# EAGLE design pc_max86150_breakout_qwiic2part_part1 (EAGLE 6.6.0)
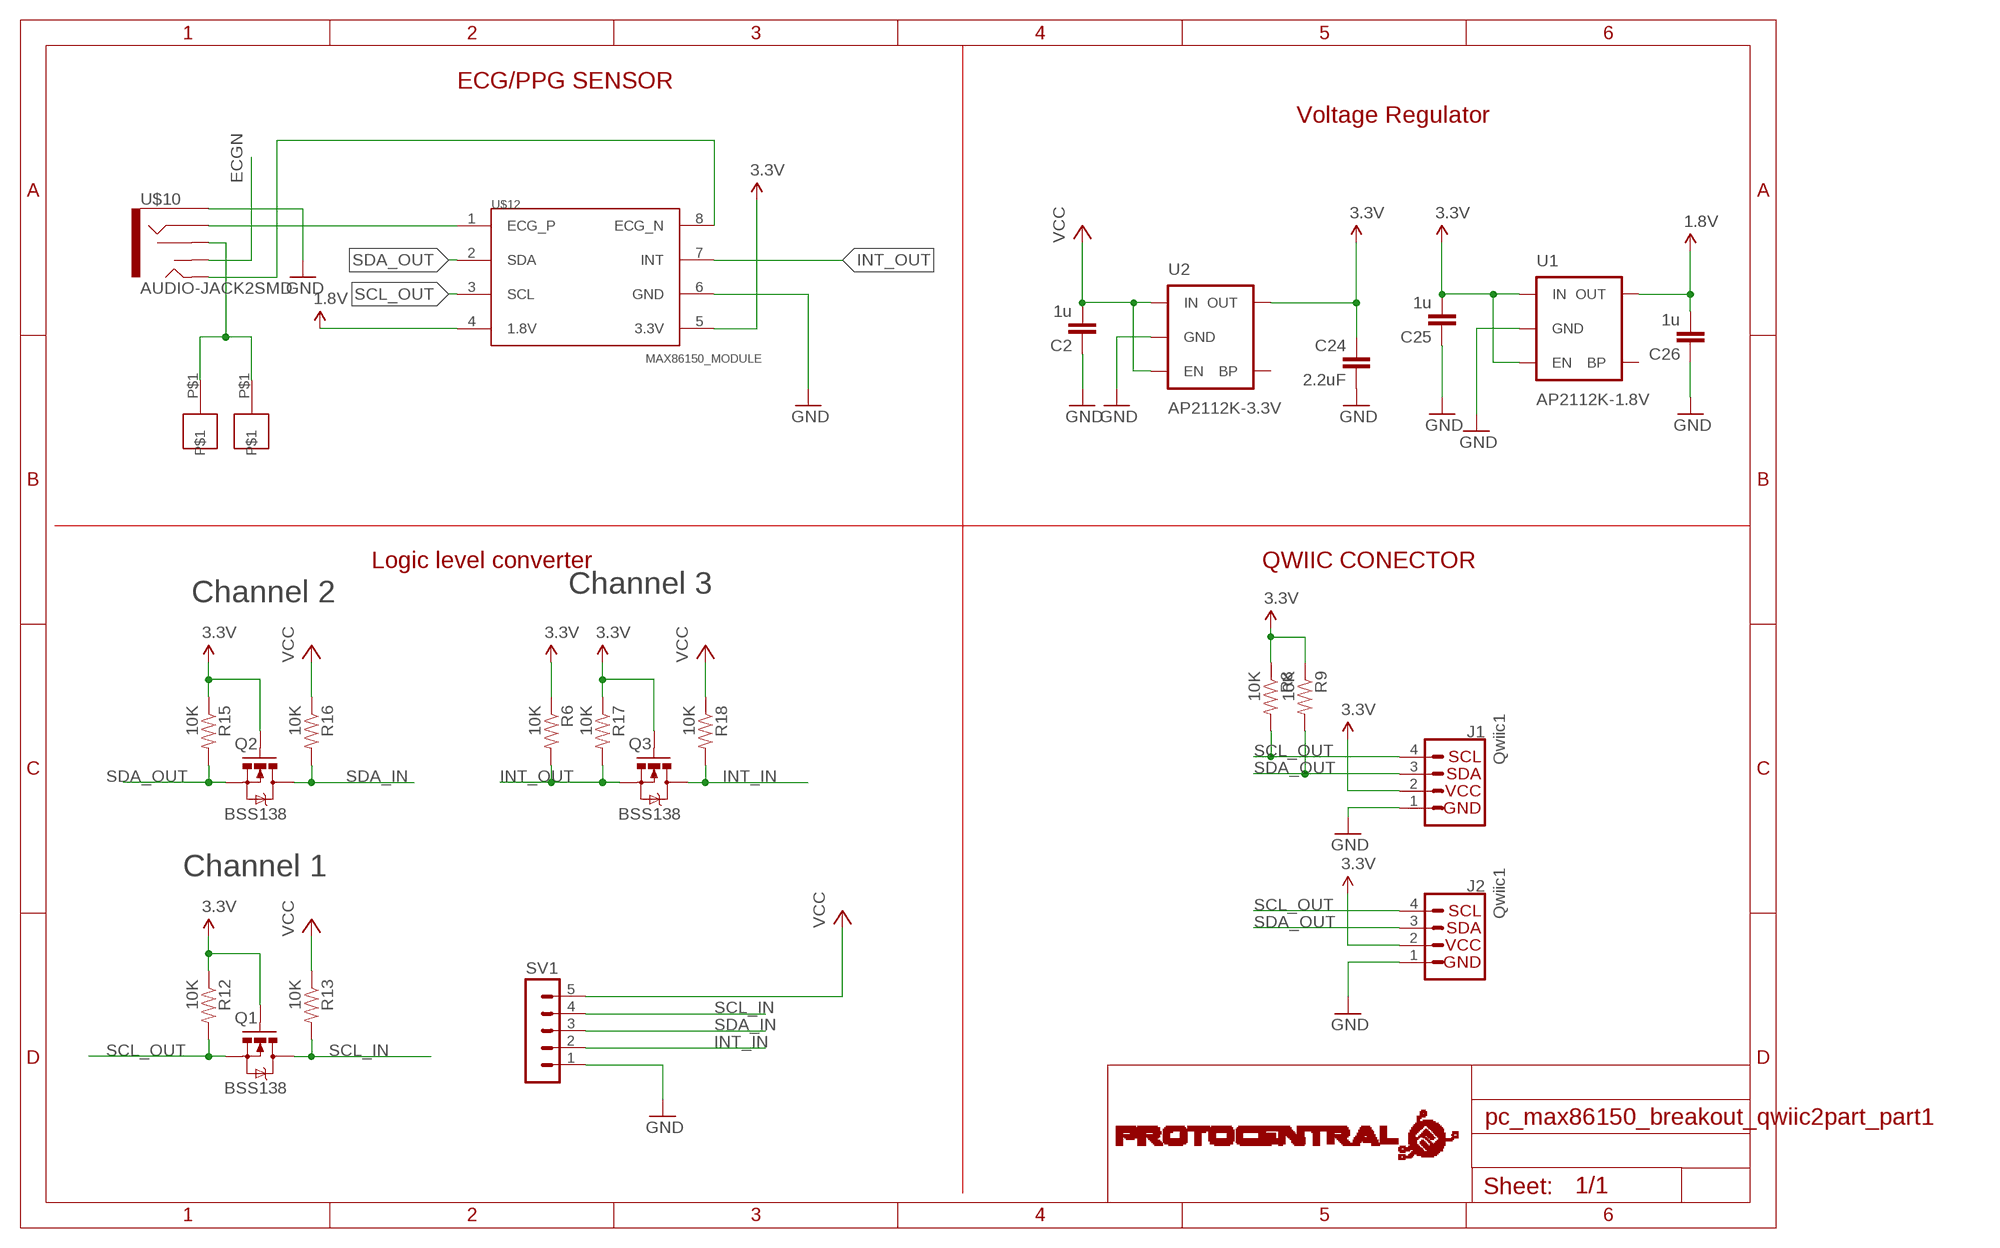
[diagram p0: schematic, sheet 1]

## Parts
C2  1u  C-EUC0402  [C0402]
C24  2.2uF  C-EUC0402  [C0402]
C25  1u  C-EUC0402  [C0402]
C26  1u  C-EUC0402  [C0402]
J1  Qwiic1  QWIIC_CONNECTORJS-1MM  [1X04_1MM_RA]
J2  Qwiic1  QWIIC_CONNECTORJS-1MM  [1X04_1MM_RA]
Q1  BSS138  MOSFET-NCHANNELSMD  [SOT23-3]
Q2  BSS138  MOSFET-NCHANNELSMD  [SOT23-3]
Q3  BSS138  MOSFET-NCHANNELSMD  [SOT23-3]
R6  10K  RESISTOR0402-RES  [0402-RES]
R8  10K  RESISTOR0402-RES  [0402-RES]
R9  10K  RESISTOR0402-RES  [0402-RES]
R12  10K  RESISTOR0402-RES  [0402-RES]
R13  10K  RESISTOR0402-RES  [0402-RES]
R15  10K  RESISTOR0402-RES  [0402-RES]
R16  10K  RESISTOR0402-RES  [0402-RES]
R17  10K  RESISTOR0402-RES  [0402-RES]
R18  10K  RESISTOR0402-RES  [0402-RES]
SV1  MA05-1  [MA05-1]
U1  AP2112K-1.8V  V_REG_LDOSMD  [SOT23-5]
U2  AP2112K-3.3V  V_REG_LDOSMD  [SOT23-5]
U$3  PROTY_LOGO_WITH_TEXT  [PROTY_WITH_TEXT]
U$4  ECG_PAD  [ECG_PAD1]
U$10  AUDIO-JACK2SMD  [AUDIO-JACK-3.5MM-SMD]
U$12  MAX86150_MODULE  [MAX86150_MODULE]
U$13  ECG_PAD  [ECG_PAD1]

## Nets
1.8V: C26.2 U1.5(OUT) U$12.4(1.8V)
3.3V: C24.1 C25.2 J1.2 J2.2 Q1.1(G) Q2.1(G) Q3.1(G) R6.1 R8.1 R9.1 R12.1 R15.1 R17.1 U1.1(IN) U1.3(EN) U2.5(OUT) U$12.5(3.3V)
ECGN: U$10.TSH
GND: C2.1 C24.2 C25.1 C26.1 J1.1 J2.1 SV1.1 U1.2(GND) U2.2(GND) U$10.SLEEVE U$12.6(GND)
INT_IN: Q3.3(D) R18.2 SV1.2
INT_OUT: Q3.2(S) R6.2 R17.2 U$12.7(INT)
N$7: U$10.TIP U$12.8(ECG_N)
N$8: U$10.RING U$12.1(ECG_P)
N$9: U$4.P$1 U$10.RSH U$13.P$1
SCL_IN: Q1.3(D) R13.2 SV1.4
SCL_OUT: J1.4 J2.4 Q1.2(S) R8.2 R12.2 U$12.3(SCL)
SDA_IN: Q2.3(D) R16.2 SV1.3
SDA_OUT: J1.3 J2.3 Q2.2(S) R9.2 R15.2 U$12.2(SDA)
VCC: C2.2 R13.1 R16.1 R18.1 SV1.5 U2.1(IN) U2.3(EN)
Unconnected: U1.4(BP) U2.4(BP)

## Notes on the sheet
- ECG/PPG SENSOR
- Voltage Regulator
- Logic level converter | QWIIC CONECTOR
- Channel 2 | Channel 3
- Channel 1

## Library data of the parts
C2 C24-C26 = rcl:C-EU: CAPACITOR, European symbol
J1 J2 = SparkFun-Connectors:QWIIC_CONNECTOR: SparkFun I2C Standard Qwiic Connector An SMD 1mm pitch JST connector makes it easy and quick (get it? Qwiic?) to connect I2C devices to each other. The Qwiic system <http://www.sparkfun.com/qwiic> enables fast and solderless connection between popular platforms and various sensors and actuators. We carry 200mm <https://www.sparkfun.com/products/14204>, 100mm <https://www.sparkfun.com/products/14205>, 50mm <https://www.sparkfun.com/products/14206>, and breadboard friendly <https://www.sparkfun.com/products/14207> Qwiic cables. We also offer 10 pcs strips <https://www.sparkfun.com/products/14323> the SMD connectors.; PROD_ID: CONN-13694
Q1-Q3 = SparkFun:MOSFET-NCHANNEL
R6 R8 R9 R12 R13 R15-R18 = SparkFun:RESISTOR: Resistor Basic schematic elements and footprints for 0603, 1206, and PTH resistors.
SV1 = con-lstb:MA05-1: PIN HEADER; OC_FARNELL: unknown; OC_NEWARK: unknown
U1 U2 = SparkFun-PowerIC:V_REG_LDO: Voltage Regulator LDO Standard 150mA LDO voltage regulator in SOT-23 layout. Micrel part MIC5205. BP (by-pass) pin is used to lower output noise with 470pF cap.; PROD_ID: VREG-12457
U$3 = circuitects:PROTY_LOGO_WITH_TEXT
U$4 U$13 = circuitects:ECG_PAD
U$10 = SparkFun:AUDIO-JACK2
U$12 = circuitects:MAX86150_MODULE

## Board
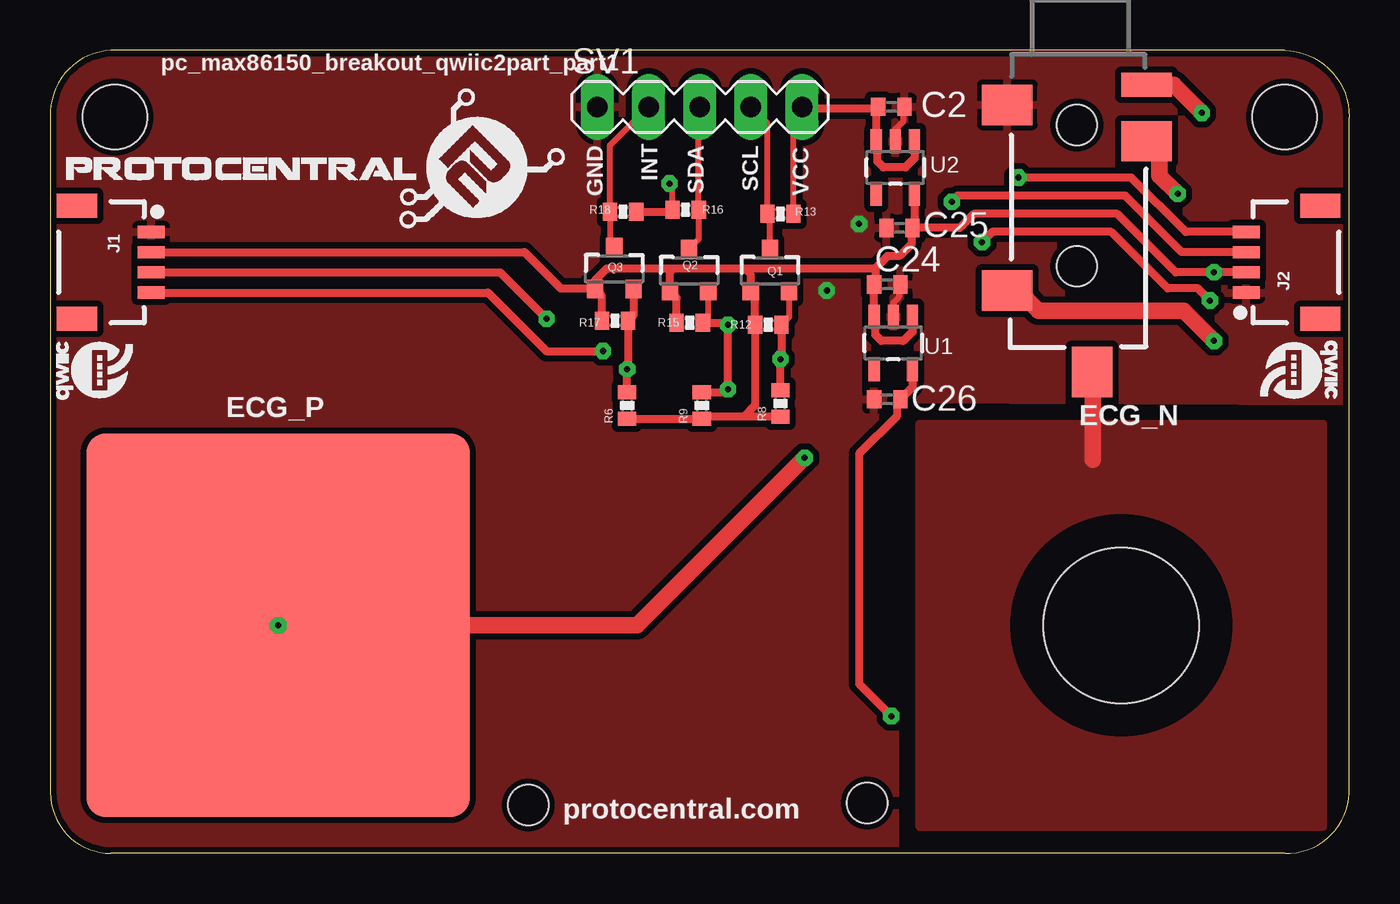
[diagram p1: board, top side]
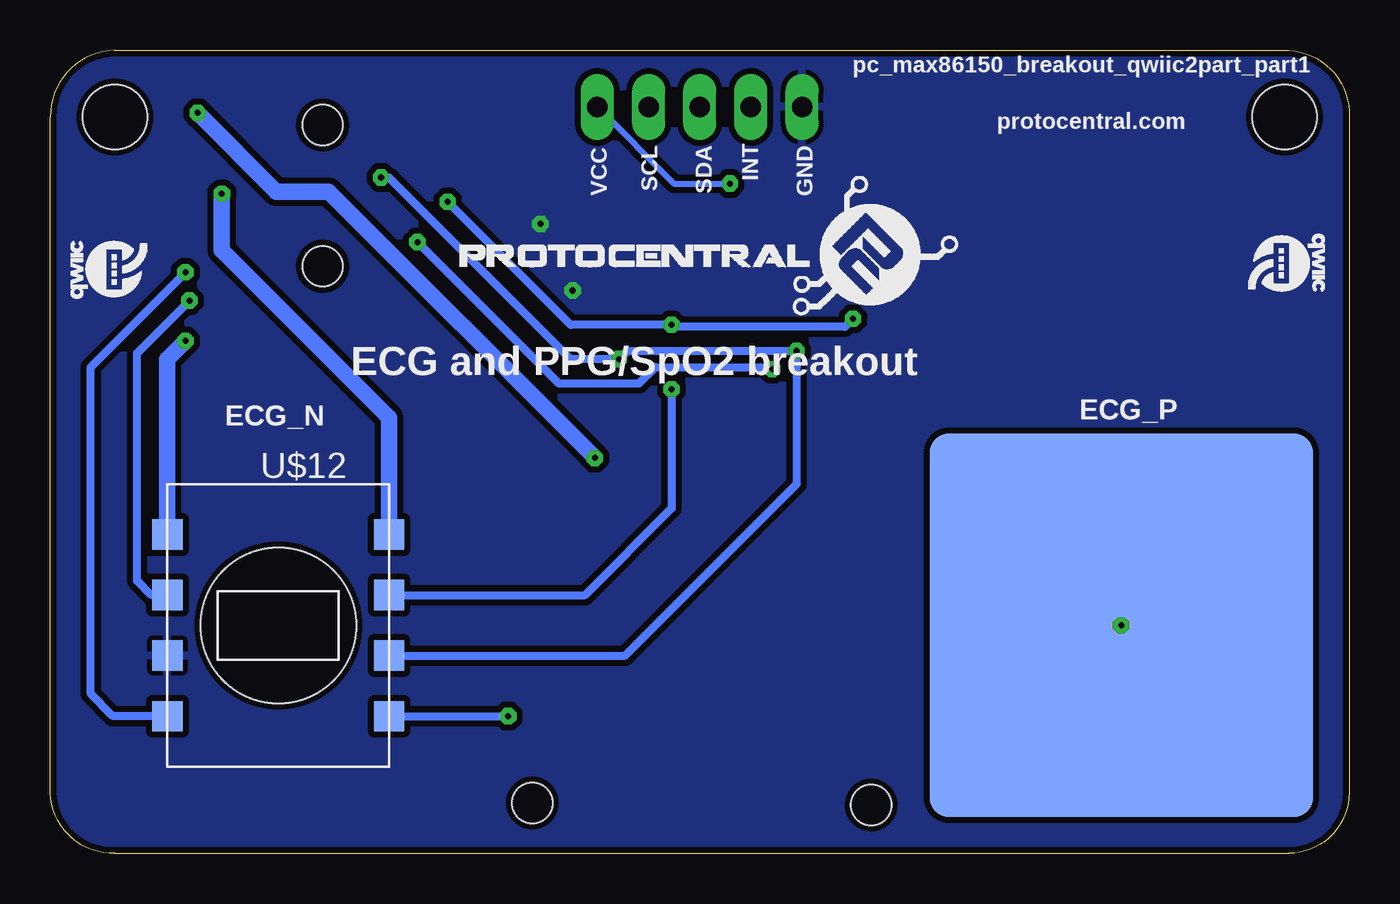
[diagram p2: board, bottom side, seen from below]

Size 64.4 x 39.8 mm. Coordinates in mm from the lower left corner, seen from the top.
Outline: 0,36.5 0,3 arc90 3,0 61.2,0 arc90 64.4,3 64.4,36.5 arc90 61.2,39.8 3,39.8 arc90 0,36.5
Copper layers (1*2*15*16): Top 0.035mm / dielectric 1.5mm / Route2 0.035mm / dielectric 0.15mm / Route15 0.035mm / dielectric 0.2mm / Bottom 0.035mm
Design rules "Circuitects-Rules": minimum track width 6mil, minimum drill 0.3mm, track to track 6mil, track to pad 6mil, pad to pad 6mil, via to via 6mil, smd to smd 6mil, copper to edge 10mil, drill to drill 8mil, minimum pad ring 12mil, minimum via ring 10mil, stop-mask expansion 4mil, vias tented up to drill 25mil, thermal gap 10mil
Holes 3.2 mm at 3.2,36.5 61.2,36.5
Holes 2 mm at 23.7,2.4 40.5,2.5
Holes 7.7 mm at 53.1,11.3
tRestrict: area 47.6,5.8 to 58.6,16.8

### Footprints (pad centres in the part's own frame; a part is rotated, then mirrored left to right if it is on the bottom)
C0402 = smd 0.7 x 0.9: 1 -0.65,0; 2 0.65,0
1X04_1MM_RA = smd 0.6 x 1.35: 1 -1.5,0; 2 -0.5,0; 3 0.5,0; 4 1.5,0 | smd 1.2 x 2: NC1 2.8,-3.675; NC2 -2.8,-3.675
SOT23-3 = smd 0.8 x 0.9: 1 -0.95,-1; 2 0.95,-1; 3 0,1.1
0402-RES = smd 0.7 x 0.9: 1 -0.65,0; 2 0.65,0
MA05-1 = drill 1.016 long: 1 -5.08,0; 2 -2.54,0; 3 0,0; 4 2.54,0; 5 5.08,0
SOT23-5 = smd 0.55 x 1.2: 1 -0.95,-1.3; 2 0,-1.3; 3 0.95,-1.3; 4 0.95,1.3; 5 -0.95,1.3
ECG_PAD1 = smd 19 x 19: P$1 0,0
AUDIO-JACK-3.5MM-SMD = smd 2 x 2.5: RING 4.3,3.45; SLEEVE 2.5,-3.45; TIP 11.7,-3.45 | smd 1.2 x 2.5: RSH 1.5,3.45 | smd 2.5 x 2: TSH 15.75,0.75 | hole 2: 3.5,0; 10.5,0
MAX86150_MODULE = smd 1.5 x 1.5 bottom: 1 -5.5,4.5; 2 -5.5,1.5; 3 -5.5,-1.5; 4 -5.5,-4.5; 5 5.5,-4.5; 6 5.5,-1.5; 7 5.5,1.5; 8 5.5,4.5

### Placement (x,y rotation side)
C2  41.7,37 180 top
C24  41.5,28.2 0 top
C25  42.1,31 0 top
C26  41.5,22.5 0 top
J1  5,29.3 270 top
J2  59.3,29.3 90 top
Q1  35.68,28.87 0 top
Q2  31.67,28.87 0 top
Q3  27.96,28.97 0 top
R6  28.6,22.2 90 top
R8  36.2,22.3 90 top
R9  32.3,22.2 90 top
R12  35.6,26.2 0 top
R13  36.2,31.7 180 top
R15  31.7,26.3 0 top
R16  31.5,31.9 0 top
R17  28,26.4 0 top
R18  28.4,31.8 180 top
SV1  32.2,37 0 top
U1  41.8,25.3 180 top
U2  41.9,34 180 top
U$3  44.1,27.04 0 bottom
U$4  11.3,11.3 270 top
U$6  [QWIIC#LABEL#FULL#M#PNG]  2.19,23.86 90 top
U$7  PROTY_LOGO_WITH_TEXT  [PROTY_WITH_TEXT]  0.8,31.36 0 top
U$9  [QWIIC#LABEL#FULL#M#PNG]  3.11,29.33 270 bottom
U$10  50.9,39.6 270 top
U$11  [QWIIC#LABEL#FULL#M#PNG]  61.49,28.86 90 bottom
U$12  53.1,11.3 0 top
U$13  11.3,11.3 270 bottom
U$59  [QWIIC#LABEL#FULL#M#PNG]  61.91,24.04 270 top

### Tracks (layer width: path | path; a pad name or v marks a point on that pad's centre or on a via)
1.8V  (via drill 0.3)
  Top 0.406: v41.7,6.8 40.1,8.4 40.1,19.8 42,21.7 42,22.35 C26.2 42.75,23.1 U1.5
  Bottom 0.406: U$12.4 v41.7,6.8
3.3V  (via drill 0.3)
  Top 0.406: J1.2 23.5,29.8 25.3,28 26.98,28 Q3.1 | U2.5 42.85,31.1 C25.2 | U1.1 42.75,25.85 42.3,25.4 41.2,25.4 40.9,25.7 40.9,26.55 U1.3 C24.1 40.9,28.25 40.9,29 | Q3.1 27.01,28.41 27.6,29 30.9,29 | C25.2 42.7,30.95 42.7,30.2 42.1,29.6 41.5,29.6 40.9,29 | 30.9,29 30.72,28.82 Q2.1 31.05,27.54 R15.1 | R17.1 27.35,27.63 Q3.1 | 30.9,29 34.4,29 | 34.4,29 40.9,29 | 34.4,29 34.73,28.67 Q1.1 34.95,27.65 R12.1 34.95,22.2 34.4,21.65 | J2.2 v57.7,28.8 55.8,28.8 52.9,31.7 45.8,31.7 45.1,31 C25.2 | R6.1 R9.1 32.4,21.65 34.4,21.65 | R8.1 34.4,21.65
  Bottom 0.406: U$12.5 61.3,6.8 62.4,7.9 62.4,24.1 v57.7,28.8
ECGN
  Top 0.813: U$10.TSH 51.7,23.85 51.7,19.5
  pour Top (rank 2): 43.1,21.3 63.1,21.3 63.1,1.3 43.1,1.3
GND  (via drill 0.3)
  Top 0.305: U2.2 41.9,35.9 42.3,36.3 42.3,36.95 C2.1 | U1.2 41.8,27.3 42.1,27.6 42.1,28.15 C24.2
  other vias: 40.1,31.2 38.5,27.9
  pour Top (isolate 0.305, rank 3): -0.4,40 -0.4,0 41.9,0.1 41.9,22.5 64.6,22.4 64.6,40
  pour Bottom (isolate 0.305): -0.4,40 -0.4,0 64.6,0 64.6,40
INT_IN
  Top 0.305: SV1.2 27.75,35.09 R18.2 27.75,30.28 Q3.3
INT_OUT  (via drill 0.3)
  Top 0.406: Q3.2 28.91,26.66 R17.2 28.65,24.05 v28.6,24 R6.2 | v57.5,27.4 56.9,28 55.4,28 52.6,30.8 46.7,30.8 v46.2,30.3
  Bottom 0.406: U$12.7 59.4,12.8 60.1,13.5 60.1,24.8 v57.5,27.4 | v46.2,30.3 39.2,23.3 35.2,23.3 34.4,24.1 28.7,24.1 v28.6,24
N$7  (via drill 0.3)
  Top 0.406: U$10.TIP 47.7,27.9
  Top 0.813: 47.7,27.9 48,27.9 49,26.9 56.2,26.9 v57.7,25.4
  Bottom 0.813: U$12.8 58.6,24.5 v57.7,25.4
N$8  (via drill 0.3)
  Top 0.406: U$10.RING 55,35.3
  Top 0.813: 55,35.3 55,33.6 v55.9,32.7
  Bottom 0.813: U$12.1 47.6,21.6 55.9,29.9 v55.9,32.7
N$9  (via drill 0.3)
  Top 0.406: U$13.P$1 8.6,8.3
  Top 0.813: U$10.RSH 55.7,38.1 v57.1,36.7 | U$13.P$1 29.1,11.3 v37.4,19.6
  Bottom 0.813: v37.4,19.6 50.6,32.8 53.2,32.8 v57.1,36.7
  other vias: 11.3,11.3
SCL_IN
  Top 0.305: Q1.3 35.68,31.57 R13.2 35.55,36.19 SV1.4
SCL_OUT  (via drill 0.3)
  Top 0.305: Q1.2 36.63,26.58 R12.2
  Top 0.406: J1.4 21.7,27.8 24.6,24.9 v27.4,24.9 | R8.2 v36.2,24.5 36.25,24.55 R12.2 | J2.4 56.3,30.8 53.6,33.5 v48,33.5
  Bottom 0.406: U$12.3 35.9,9.8 27.4,18.3 v27.4,24.9 35.8,24.9 v36.2,24.5 38.6,24.5 47.6,33.5 v48,33.5
SDA_IN
  Top 0.305: SV1.3 32.15,36.95 R16.2 32.15,30.45 Q2.3
SDA_OUT  (via drill 0.3)
  Top 0.305: Q2.2 32.62,26.57 R15.2
  Top 0.406: J1.3 22.3,28.8 v24.6,26.5 | R15.2 33.5,26.3 v33.6,26.2 v33.6,23 33.45,22.85 R9.2 | J2.3 56.1,29.8 53.3,32.6 45,32.6 v44.7,32.3
  Bottom 0.406: v24.6,26.5 25,26.1 33.5,26.1 v33.6,26.2 38.6,26.2 v44.7,32.3 | U$12.2 37.9,12.8 33.6,17.1 v33.6,23
VCC  (via drill 0.3)
  Top 0.305: R13.1 36.85,36.57 SV1.5 | R16.1 30.85,33.05 v30.7,33.2
  Top 0.406: R18.1 30.75,31.8 R16.1 | 40.85,35.2 U2.3 | U2.3 40.95,36.9 | 40.95,36.9 C2.2 | U2.1 42.85,34.45 42.4,34 41.3,34 41,34.3 41,35.25 U2.3 | 40.95,36.9 37.38,36.9 SV1.5
  Bottom 0.305: SV1.5 33.48,33.2 v30.7,33.2

### Text on the board
tPlace: pc_max86150_breakout_qwiic2part_part1 | GND | INT | SDA | SCL | VCC | ECG_P | ECG_N | protocentral.com
bPlace: pc_max86150_breakout_qwiic2part_part1 | protocentral.com | GND | INT | SDA | SCL | VCC | ECG and PPG/SpO2 breakout | ECG_P | ECG_N